# Altium schematic sheet HAE_Actuators.SchDoc
size A; SheetNumber: 4; SheetTotal: 6
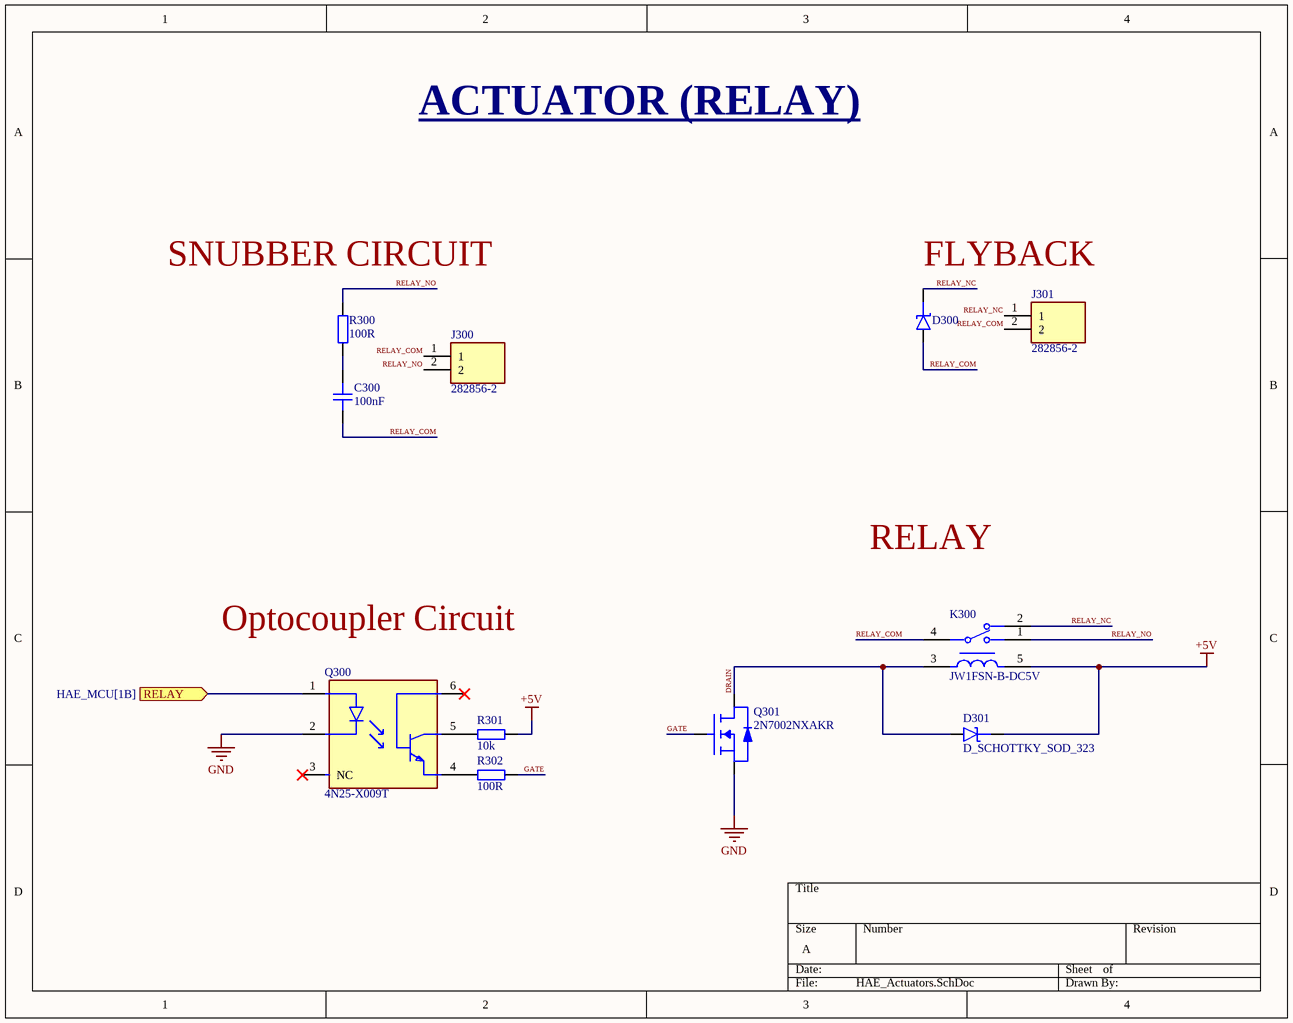
[diagram p0: HAE_Actuators.SchDoc]

## Parts
C300  100nF  [CAP_0603]
D300  D_SCHOTTKY_SOD_323  [SOD-323]  (value not drawn)
D301  D_SCHOTTKY_SOD_323  [SOD-323]
J300  282856-2  [TE_282856-2]
J301  282856-2  [TE_282856-2]
K300  JW1FSN-B-DC5V  [FP-JW1FSN-B-DC5V-MFG]
Q300  4N25-X009T  [FP-4N25-X009T-MFG]
Q301  2N7002NXAKR  [SSM3J338R,LF-SOT23-F]
R300  100R  [RES_0402]
R301  10k  [RES_0402]
R302  100R  [RES_0402]

## Ports
RELAY (in, see HAE_MCU[1B])

## Nets
+5V: D301.K K300.5 R301.2
GND: Q300.2(C) Q301.S
DRAIN: D301.A K300.3 Q301.D
GATE: Q301.G R302.2
RELAY: Q300.1(A) ; port RELAY
RELAY_COM: C300.1 D300.A J300.1 J301.2 K300.4
RELAY_NC: D300.K J301.1 K300.2
RELAY_NO: J300.2 K300.1 R300.1
NetC300_2: C300.2 R300.2
NetQ300_4: Q300.4(E) R302.1
NetQ300_5: Q300.5(C) R301.1

Not connected (* = marked no-connect by the designer): Q300 3(NC)* 6(B)*

## Notes on the sheet
- ACTUATOR (RELAY)
- (near R300) SNUBBER CIRCUIT
- FLYBACK
- RELAY
- Optocoupler Circuit

## Library data of the parts
C300 = CAP_0603: Capacitor SMD 0603; Manufacturer: *; Manufacturer Part Number: *; Distributor Link: *; LCSC: *; Rating: *; Dielectric: *
D300 D301 = D_SCHOTTKY_SOD_323: Diode Schottky SMD SOD-323
J300 J301 = 282856-2: TERMI-BLOK PCB MOUNT 2P; MF: TE Connectivity; Purchase-URL: https://pricing.snapeda.com/search/part/282856-2/?ref=eda; Package: None; MP: 282856-2; EU_RoHS_Compliance: Compliant with Exemptions; Price: None; Availability: In Stock; Value: *; Check_prices: https://www.snapeda.com/parts/282856-2/TE+Connectivity+AMP+Connectors/view-part/?ref=eda; SnapEDA_Link: https://www.snapeda.com/parts/282856-2/TE+Connectivity+AMP+Connectors/view-part/?ref=snap
K300 = CMP-05606-000101-1: RELAY GEN PURPOSE SPDT 10A 5V; Ratings: IP67; Operate Time: 15ms; Coil Type: Non-Latching; Max Voltage Rating (DC): 30V; Voltage Rating (AC): 250V; Coil Current: 106mA; Coil Resistance: 47R; Relay Type: General Purpose; Switching Capacity: 300W; Test Voltage: 5kV; Power Consumption: 530mW; Release Time: 5ms; Length: 28.6mm; Mount: Through Hole; Min Operating Temperature: -40°C; Package Quantity: 100; RoHS Compliant: Yes; Max Current Rating: 10A; Coil Voltage (DC): 5V; Series: JW; Switching Current: 10A; Contact Material: Silver; Throw Configuration: SPDT; Packaging: Bulk; Voltage Rating (DC): 30V; Contact Current Rating: 10A; Max Voltage Rating (AC): 250V; Depth: 12.8mm; Termination: PC Pin; Number of Pins: 5; Lead Free: Lead Free; Max Operating Temperature: 85°C; Coil Power: 530mW; Radiation Hardening: No
Q300 = CMP-00030-12292229-1: 4N25-X009T Optocoupler DC-IN 1-CH Transistor With Base DC-OUT 6-Pin PDIP SMD T/R; Max Collector Current: 100mA; Number of Channels: 1; Forward Current: 60mA; Collector Emitter Saturation Voltage: 500mV; Collector Emitter Voltage (VCEO): 70V; Output Current per Channel: 50mA; Current Transfer Ratio: 50%; Max Power Dissipation: 150mW; Forward Voltage: 1.36V; Reverse Breakdown Voltage: 6V; NexarPartId: 12292229; Radiation Hardening: No; Min Operating Temperature: -55°C; Packaging: Tape & Reel (TR); Lead Free: Lead Free; Number of Pins: 6; Max Output Voltage: 70V; RoHS: Compliant; Contact Plating: Tin; Case/Package: SMD/SMT; Number of Elements: 1; Max Operating Temperature: 100°C; Mount: Surface Mount; Power Dissipation: 150mW; Max Input Current: 60mA
Q301 = 2N7002NXAKR: MOSFET N-Channel Vds=60V Id=300mA with ESD Protection; Manufacturer: Nexperia; Manufacturer Part Number: 2N7002NXAKR
R300-R302 = RES_0402: Resistor SMD 0402; Manufacturer: *; Manufacturer Part Number: *; Distributor Link: *; LCSC: *